# EAGLE schematic water_height_monitoring_system_v1 (EAGLE 9.7.0)
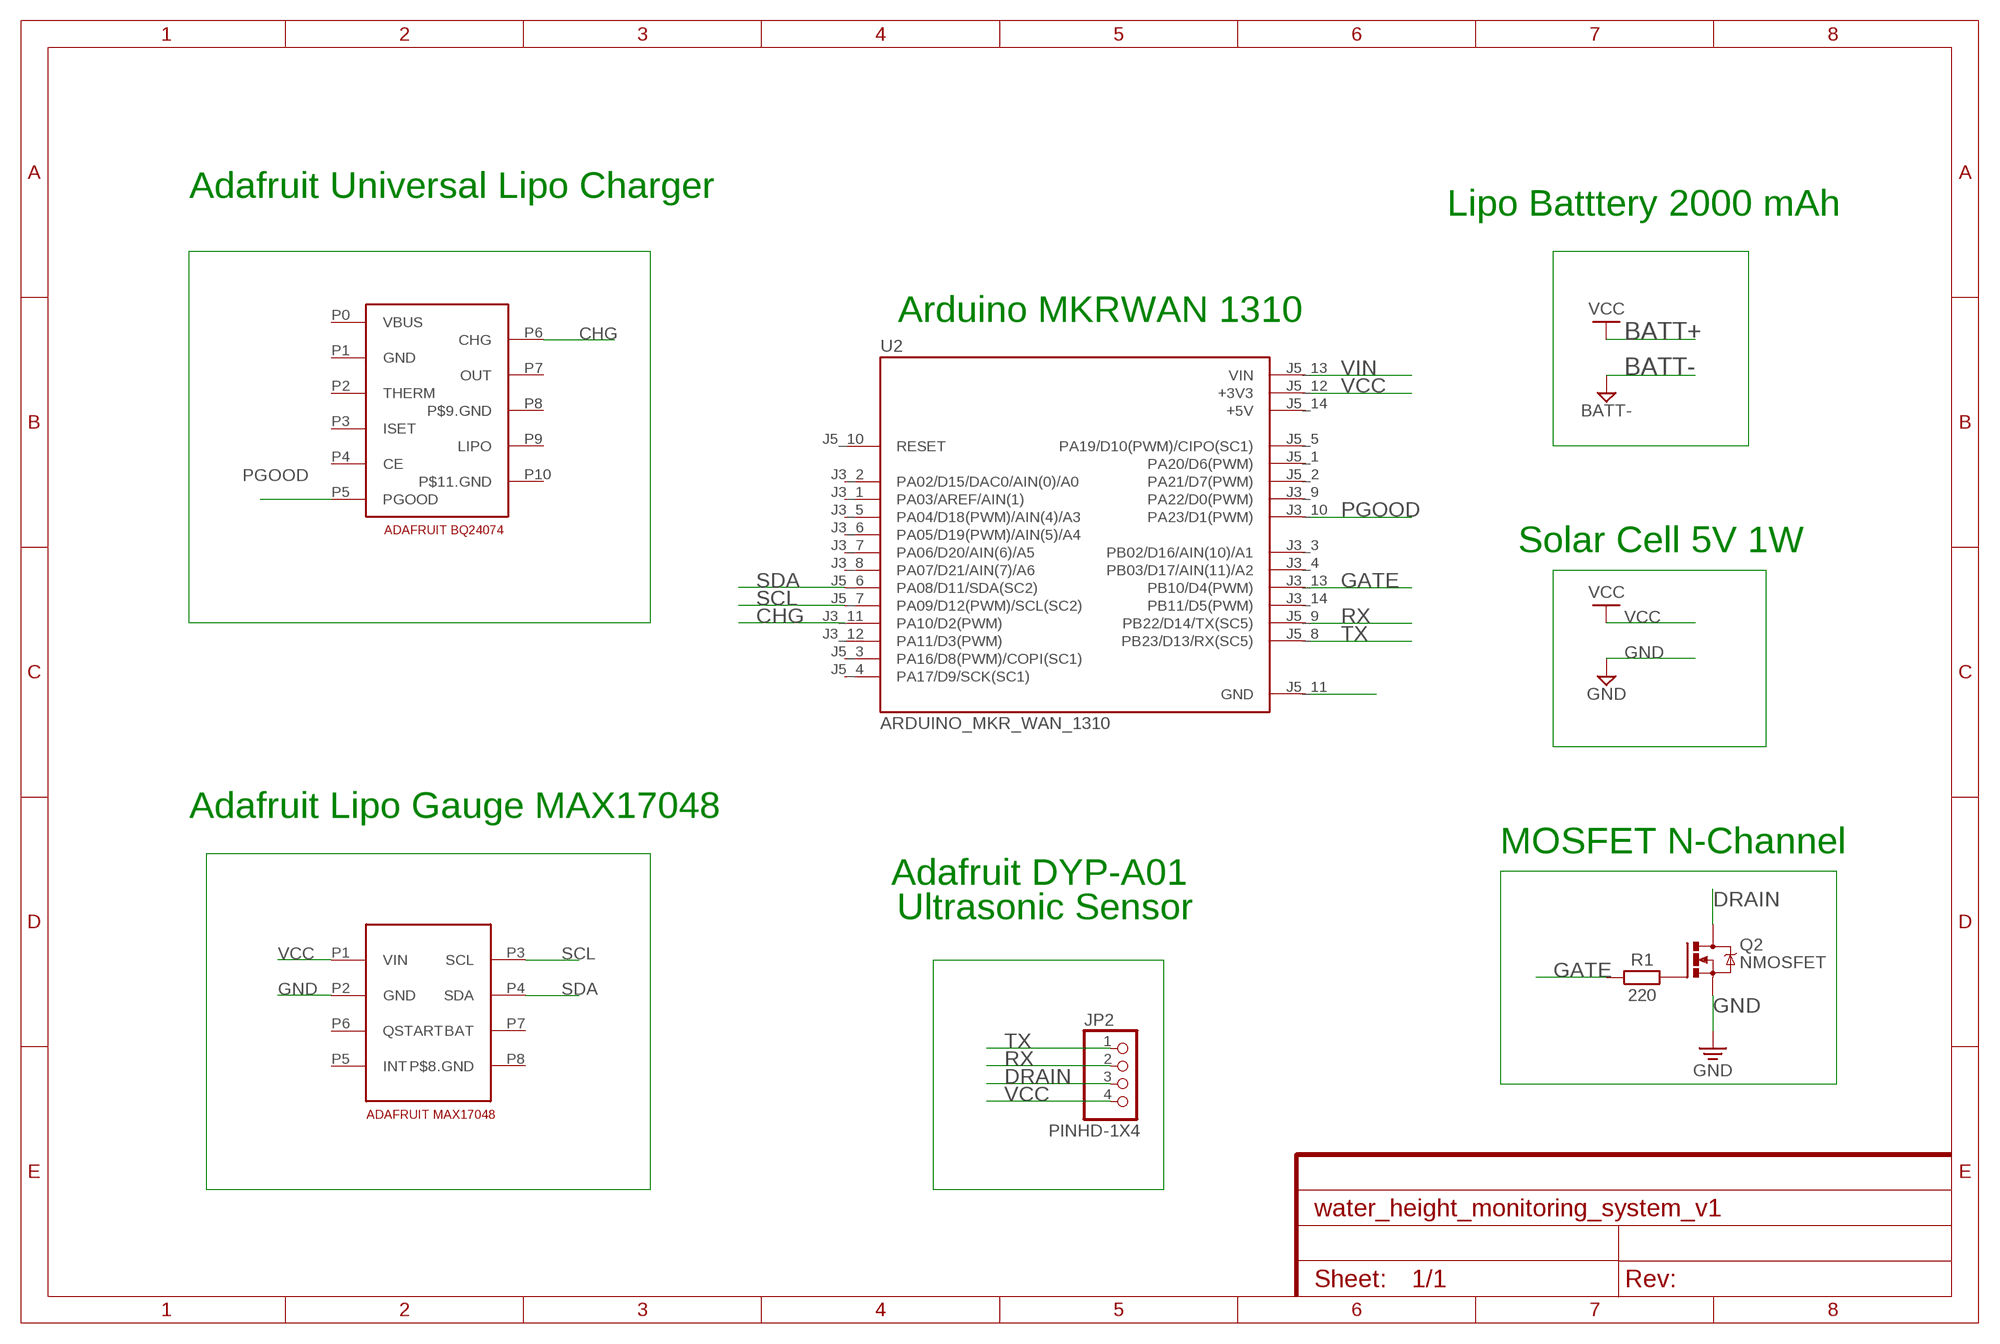
[diagram p0: schematic, sheet 1]

## Parts
JP2  PINHD-1X4  [1X04]
Q2  NMOSFET  NMOSFET_TO220  [TO220BV]
R1  220  RESISTOR__AXIAL-7.2MM-PITCH  [RESAD724W46L381D178B]
U2  ARDUINO_MKR_WAN_1310  [BOARD_ARDUINO_MKR_WAN_1310]
U$2  ADAFRUIT_BQ24074  [BQ24074_MODULE]
U$3  ADAFRUIT_MAX17048  [MAX17048]

## Nets
CHG: U2.J3_11(PA10/D2(PWM)) U$2.P6(CHG)
DRAIN: JP2.3 Q2.D
GATE: R1.1 U2.J3_13(PB10/D4(PWM))
GND: Q2.S U$3.P2(GND)
N$4: U2.J5_11(GND)
N$7: Q2.G R1.2
PGOOD: U2.J3_10(PA23/D1(PWM)) U$2.P5(PGOOD)
RX: JP2.2 U2.J5_9(PB22/D14/TX(SC5))
SCL: U2.J5_7(PA09/D12(PWM)/SCL(SC2)) U$3.P3(SCL)
SDA: U2.J5_6(PA08/D11/SDA(SC2)) U$3.P4(SDA)
TX: JP2.1 U2.J5_8(PB23/D13/RX(SC5))
VCC: JP2.4 U2.J5_12(+3V3) U$3.P1(VIN)
VIN: U2.J5_13(VIN)
Unconnected: U2.J3_1(PA03/AREF/AIN(1)) U2.J3_2(PA02/D15/DAC0/AIN(0)/A0) U2.J3_3(PB02/D16/AIN(10)/A1) U2.J3_4(PB03/D17/AIN(11)/A2) U2.J3_5(PA04/D18(PWM)/AIN(4)/A3) U2.J3_6(PA05/D19(PWM)/AIN(5)/A4) U2.J3_7(PA06/D20/AIN(6)/A5) U2.J3_8(PA07/D21/AIN(7)/A6) U2.J3_9(PA22/D0(PWM)) U2.J3_12(PA11/D3(PWM)) U2.J3_14(PB11/D5(PWM)) U2.J5_1(PA20/D6(PWM)) U2.J5_2(PA21/D7(PWM)) U2.J5_3(PA16/D8(PWM)/COPI(SC1)) U2.J5_4(PA17/D9/SCK(SC1)) U2.J5_5(PA19/D10(PWM)/CIPO(SC1)) U2.J5_10(RESET) U$2.P2(THERM) U$2.P3(ISET) U$2.P4(CE) U$2.P7(OUT) U$3.P5(INT) U$3.P6(QSTART)

## Notes on the sheet
- Adafruit Universal Lipo Charger
- Lipo Batttery 2000 mAh
- Arduino MKRWAN 1310
- Solar Cell 5V 1W
- Adafruit Lipo Gauge MAX17048
- MOSFET N-Channel
- Adafruit DYP-A01
   Ultrasonic Sensor

## Power pins joined to a net without a drawn wire
+5V: U2.J5_14(+5V)
BAT: U$3.P7(BAT)
GND: U$2.P1(GND)
LIPO: U$2.P9(LIPO)
P$8.GND: U$3.P8(P$8.GND)
P$9.GND: U$2.P8(P$9.GND)
P$11.GND: U$2.P10(P$11.GND)
VBUS: U$2.P0(VBUS)

## Library data of the parts
JP2 = Connector:PINHD-1X4: PIN HEADER; CATEGORY: Headers; DESCRIPTION: Header, Straight, 4 Position; MANUFACTURER: Generic; MPN: Generic; OPERATING_TEMPERATURE: Generic; PART_STATUS: Active; PITCH: 0.100" (2.54mm); ROHS_COMPLIANCE: Generic; SERIES: Generic; SUB-CATEGORY: Headers, Male Pins; TYPE: Board to Board or Cable, Unshrouded, Through Hole, Straight
Q2 = Transistor:NMOSFET: N-Channel MOSFET - Generic; CATEGORY: Transistor; SUB-CATEGORY: MOSFET; TYPE: N-Channel
R1 = Tinkercad:RESISTOR: Resistor Fixed - Generic; CATEGORY: Resistor; SUB-CATEGORY: Fixed
U2 = Library:ARDUINO_MKR_WAN_1310: Check availability <https://pricing.snapeda.com/parts/ARDUINO%20MKR%20WAN%201310/Arduino/view-part?ref=eda>; AVAILABILITY: Not in stock; CHECK_PRICES: https://www.snapeda.com/parts/ARDUINO%20MKR%20WAN%201310/Arduino/view-part/?ref=eda; DESCRIPTION: Arduino Pro; LoRa; SAM D21; 5VDC; Flash: 256kB; SRAM: 32kB; MF: Arduino; MP: ARDUINO MKR WAN 1310; PACKAGE: None; PRICE: None; SNAPEDA_LINK: https://www.snapeda.com/parts/ARDUINO%20MKR%20WAN%201310/Arduino/view-part/?ref=snap
U$2 = Library:ADAFRUIT_BQ24074
U$3 = Library:ADAFRUIT_MAX17048